# Altium schematic sheet Power_Unit.SchDoc
size A3
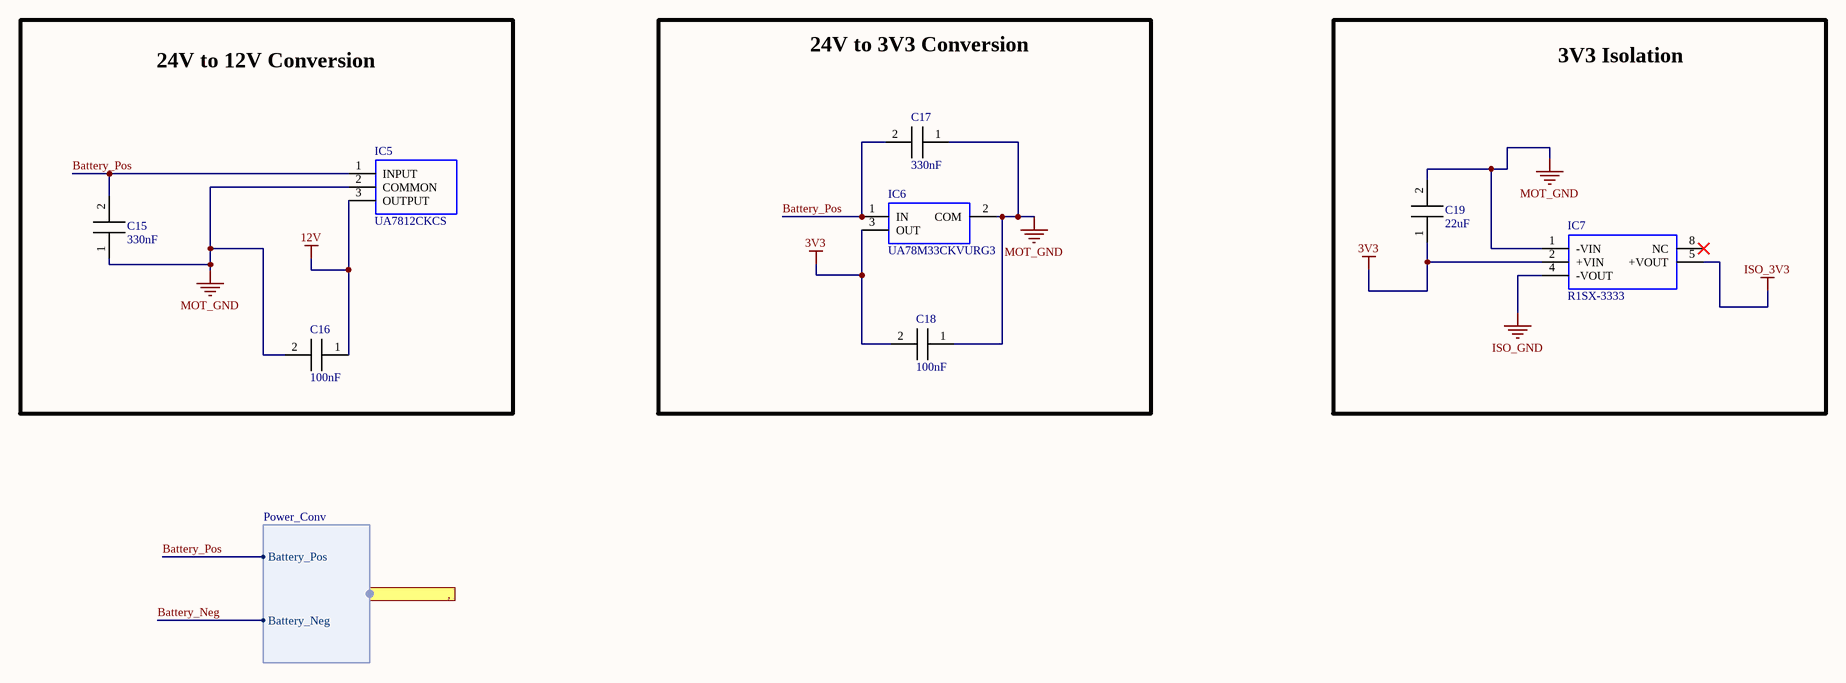
[diagram p0: Power_Unit.SchDoc]

## Parts
C15  Parameter 1: 330nF  (hidden comment: CAP 330nF)
C16  Parameter 1: 100nF  (hidden comment: CAP 100nF)
C17  Parameter 1: 330nF  (hidden comment: CAP 330nF)
C18  Parameter 1: 100nF  (hidden comment: CAP 100nF)
C19  Parameter 1: 22uF  (hidden comment: CAP  22uF)
IC5  UA7812CKCS  [UA7812CKCS]
IC6  UA78M33CKVURG3  [UA78M33CKVURG3]
IC7  R1SX-3333  [R1SX_3333]

## Ports
, (harness Power_Conv)

## Harnesses
Power_Conv: Battery_Pos, Battery_Neg

## Nets
3V3: C18.2 C19.1 IC6.3(OUT) IC7.2(+VIN)
12V: C16.1 IC5.3(OUTPUT)
ISO_3V3: IC7.5(+VOUT)
ISO_GND: IC7.4(-VOUT)
MOT_GND: C15.1 C16.2 C17.1 C18.1 C19.2 IC5.2(COMMON) IC6.2(COM) IC7.1(-VIN)
Battery_Neg: port ,.Battery_Neg
Battery_Pos: C15.2 C17.2 IC5.1(INPUT) IC6.1(IN) ; port ,.Battery_Pos

Not connected (* = marked no-connect by the designer): IC7 8(NC)*

## Notes on the sheet
- 24V to 12V Conversion
- (near C17) 24V to 3V3 Conversion
- 3V3 Isolation
- Title
- Size:
- Date:
- A3
- Number:
- Time:
- Revision:
- Sheet
- of
- File:

## Library data of the parts
IC5 = IC, LVR, UA7812CKCS
IC6 = IC, LVR, UA78M33CKVURG3, 24/3V3
IC7 = IC, DC/DC, ISO, R1SX-3333